# Altium schematic sheet Power.SchDoc: Power banks
size A4; Author: Lucas Liaño; Revision: 1; SheetNumber: 7; SheetTotal: 8
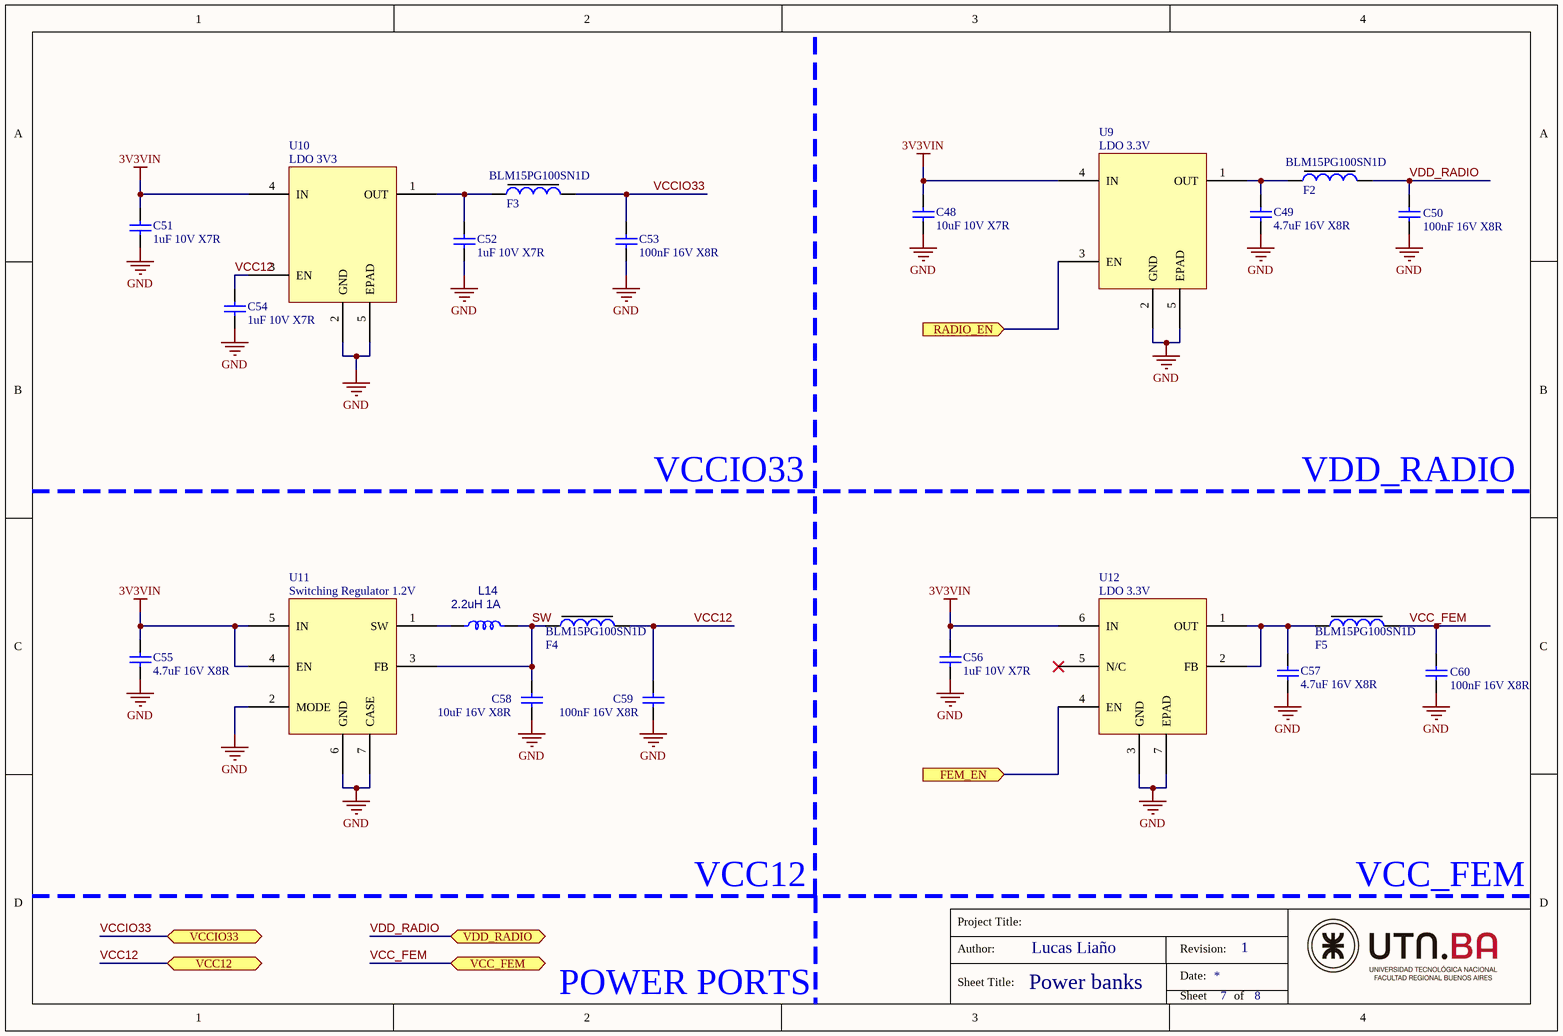
[diagram p0: Power.SchDoc]

## Parts
C48  10uF 10V X7R  [C_0603]
C49  4.7uF 16V X8R  [C_0603]
C50  100nF 16V X8R  [C_0603]
C51  1uF 10V X7R  [C_0603]
C52  1uF 10V X7R  [C_0603]
C53  100nF 16V X8R  [C_0603]
C54  1uF 10V X7R  [C_0603]
C55  4.7uF 16V X8R  [C_0603]
C56  1uF 10V X7R  [C_0603]
C57  4.7uF 16V X8R  [C_0603]
C58  10uF 16V X8R  [C_0603]
C59  100nF 16V X8R  [C_0603]
C60  100nF 16V X8R  [C_0603]
F2  BLM15PG100SN1D  [L_0402]
F3  BLM15PG100SN1D  [L_0402]
F4  BLM15PG100SN1D  [L_0402]
F5  BLM15PG100SN1D  [L_0402]
L14  2.2uH 1A  [L_1008]
U9  LDO 3.3V  [UDFN4_1x1mm]
U10  LDO 3V3  [UDFN4_1x1mm]
U11  Switching Regulator 1.2V  [WSON-6]
U12  LDO 3.3V  [XDFN6_1.2X1.2mm]

## Ports
FEM_EN (in), RADIO_EN (in), VCC12 (bidir), VCC_FEM (bidir), VCCIO33 (bidir), VDD_RADIO (bidir)

## Nets
3V3VIN: C48.1 C51.1 C55.1 C56.1 U9.4(IN) U10.4(IN) U11.4(EN) U11.5(IN) U12.6(IN)
GND: C48.2 C49.2 C50.2 C51.2 C52.2 C53.1 C54.1 C55.2 C56.2 C57.2 C58.2 C59.2 C60.2 U9.2(GND) U9.5(EPAD) U10.2(GND) U10.5(EPAD) U11.2(MODE) U11.6(GND) U11.7(CASE) U12.3(GND) U12.7(EPAD)
FEM_EN: U12.4(EN) ; port FEM_EN
RADIO_EN: U9.3(EN) ; port RADIO_EN
SW: C58.1 F4.1 L14.2 U11.3(FB)
VCC12: C54.2 C59.1 F4.2 U10.3(EN) ; port VCC12
VCC_FEM: C60.1 F5.2 ; port VCC_FEM
VCCIO33: C53.2 F3.2 ; port VCCIO33
VDD_RADIO: C50.1 F2.2 ; port VDD_RADIO
NetC49_1: C49.1 F2.1 U9.1(OUT)
NetC52_1: C52.1 F3.1 U10.1(OUT)
NetC57_1: C57.1 F5.1 U12.1(OUT) U12.2(FB)
NetL14_1: L14.1 U11.1(SW)

Not connected (* = marked no-connect by the designer): U12 5(N/C)*

## Notes on the sheet
- VCCIO33
- VDD_RADIO
- VCC12
- Project Title:
- VCC_FEM
- Author:
- Sheet Title:
- Date:
- Revision:
- POWER PORTS
- Sheet
- of

## Library data of the parts
C48 = Cap: Capacitor; MPN: C2012X7R1A106K125AC; Manufacturer: TDK Corportation; Package: 0603; Price (USD): 0.3; ComponentLink2Description: SupplierLink; ComponentLink1Description: Datasheet; ComponentLink2URL: https://www.digikey.com/es/products/detail/tdk-corporation/C2012X7R1A106K125AC/2619198; ComponentLink1URL: https://www.digikey.com/es/products/detail/tdk-corporation/C2012X7R1A106K125AC/2619198; Value: 10uF 10V X7R; Supplier: Digikey
C49 C55 C57 = Cap: Capacitor; MPN: CGA5L3X8R1C475M160AB; Manufacturer: TDK Corporation; Package: 0603; Price (USD): 0.8; ComponentLink2Description: SupplierLink; ComponentLink1Description: Datasheet; Value: 4.7uF 16V X8R; Supplier: Digikey
  C49 C55: ComponentLink2URL: *; ComponentLink1URL: *
  C57: ComponentLink2URL: https://www.digikey.com/es/products/detail/tdk-corporation/CGA5L3X8R1C475M160AB/3950218; ComponentLink1URL: https://www.digikey.com/es/products/detail/tdk-corporation/CGA5L3X8R1C475M160AB/3950218
C50 C53 C59 C60 = Cap: Capacitor; MPN: C1206C104K4HACAUTO; Manufacturer: KEMET; Package: 0603; Price (USD): 0.3; ComponentLink2Description: SupplierLink; ComponentLink1Description: Datasheet; Value: 100nF 16V X8R; Supplier: Digikey
  C50 C59 C60: ComponentLink2URL: *; ComponentLink1URL: *
  C53: ComponentLink2URL: https://www.digikey.com/es/products/detail/kemet/C1206C104K4HACAUTO/7961523; ComponentLink1URL: https://www.digikey.com/es/products/detail/kemet/C1206C104K4HACAUTO/7961523
C51 C52 C54 C56 = Cap: Capacitor; MPN: C0603C105K8RAC7867; Manufacturer: KEMET; Package: 0603; Price (USD): 0.1; ComponentLink2Description: SupplierLink; ComponentLink1Description: Datasheet; Value: 1uF 10V X7R; Supplier: Digikey
  C51: ComponentLink2URL: https://www.digikey.com/es/products/detail/kemet/C0603C105K8RAC7867/2199790; ComponentLink1URL: https://www.digikey.com/es/products/detail/kemet/C0603C105K8RAC7867/2199790
  C52 C54 C56: ComponentLink2URL: *; ComponentLink1URL: *
C58 = Cap: Capacitor; MPN: CGA6P3X8R1C106M250AB; Manufacturer: TDK Corporation; Package: 0603; Price (USD): 0.8; ComponentLink2Description: SupplierLink; ComponentLink1Description: Datasheet; ComponentLink2URL: https://www.digikey.com/es/products/detail/tdk-corporation/CGA6P3X8R1C106M250AB/3950293; ComponentLink1URL: https://www.digikey.com/es/products/detail/tdk-corporation/CGA6P3X8R1C106M250AB/3950293; Value: 10uF 16V X8R; Supplier: Digikey
F2-F5 = Ferrite beads: Ferrite bead 10 ohm 1A; Manufacturer: Murata Electronics; ComponentLink1Description: Datasheet; ComponentLink2Description: SupplierLink; MPN: BLM15PG100SN1D; Package: 0402; Price (USD): 0.1; Supplier: Digikey; Value: Ferrite bead 10 ohm 1A
  F5: ComponentLink1URL: https://www.murata.com/en-us/products/productdata/8796740059166/ENFA0018.pdf; ComponentLink2URL: https://www.digikey.com/en/products/detail/murata-electronics/BLM15PG100SN1D/2587980?s=N4IgTCBcDaIEIBkCyBGArABQOIoAy4GUA5FAERAF0BfIA
L14 = IND: FIXED IND 2.2UH 1A 150 MOHM; Manufacturer: Murata Electronics; MPN: LQM2HPN2R2MJ0L; Package: 1008; Price (USD): 0.24; Value: 2.2uH 1A; ComponentLink1Description: Datasheet; ComponentLink1URL: https://search.murata.co.jp/Ceramy/image/img/P02/JELF243B-0016.pdf; ComponentLink2Description: SupplierLink; ComponentLink2URL: https://www.digikey.com/en/products/detail/murata-electronics/LQM2HPN2R2MJ0L/2594611?s=N4IgTCBcDaIDIEUCyYASAFAcmASmJAUgAxwgC6AvkA; Supplier: Digikey
U9 = NCP114: LDO IC Positive Fixed 1 Output 300mA 4-UDFN (1.0x1.0); Manufacturer: onsemi; MPN: NCP114AMX330TBG; ComponentLink1Description: Datasheet; ComponentLink1URL: https://www.onsemi.com/pdf/datasheet/ncp114-d.pdf; ComponentLink2Description: SupplierLink; ComponentLink2URL: https://www.digikey.com/en/products/detail/onsemi/NCP114AMX330TBG/6166731?s=N4IgTCBcDaIHIGEAKBGFAWAggWQBoGZ8AGAFQCEBxEAXQF8g; Package: 4UDFN; Price (USD): 0.48; Supplier: Digikey; Value: LDO 3.3V
U10 = NCP103: LDO IC Positive Fixed 1 Output 150mA 4-UDFN; Manufacturer: onsemi; MPN: NCP103AMX300TCG; Value: LDO 3V; ComponentLink1Description: Datasheet; ComponentLink1URL: https://www.onsemi.com/pdf/datasheet/ncp103-d.pdf; ComponentLink2Description: SupplierLink; ComponentLink2URL: https://www.digikey.com/en/products/detail/onsemi/NCP103AMX300TCG/5022525?s=N4IgTCBcDaIHIGEAKBGADAZgIIFkAaGaaAKggOIgC6AvkA; Package: 4-UDFN (1.0x1.0); Price (USD): 0.07; Supplier: Digikey
U11 = TPS62242DRV: Switching Regulator IC Positive Fixed 1.2V 1 Output 300mA 6-WDFN; Manufacturer: Texas Instruments; MPN: TPS62242DRVT; ComponentLink1Description: Datasheet; ComponentLink1URL: https://www.ti.com/lit/ds/symlink/tps62242.pdf?HQS=dis-dk-null-digikeymode-dsf-pf-null-wwe&ts=1656025395113; ComponentLink2Description: SupplierLink; ComponentLink2URL: https://www.digikey.com/en/products/detail/texas-instruments/TPS62242DRVT/1739884; Package: 6-WDFN Exposed Pad; Price (USD): 1.66; Supplier: Digikey; Value: Switching Regulator 1.2V
U12 = NCP176BMX330TCG: LDO IC Positive Fixed 1 Output 500mA 6-XDFN (1.2x1.2); Manufacturer: onsemi; ComponentLink1Description: Datasheet; ComponentLink1URL: https://www.onsemi.com/pdf/datasheet/ncp176-d.pdf; ComponentLink2Description: SupplierLink; ComponentLink2URL: https://www.digikey.com/en/products/detail/onsemi/NCP176BMX330TCG/5817227?s=N4IgTCBcDaIHIGEAKBGA7ANgEIFkAaAzAQAwAqCA4iALoC%2BQA; MPN: NCP176BMX330TCG; Package: 6-XDFN (1.2x1.2); Price (USD): 0.47; Supplier: Digikey; Value: LDO 3.3V